# EAGLE design radio-v1.0 (EAGLE 8.1.0)
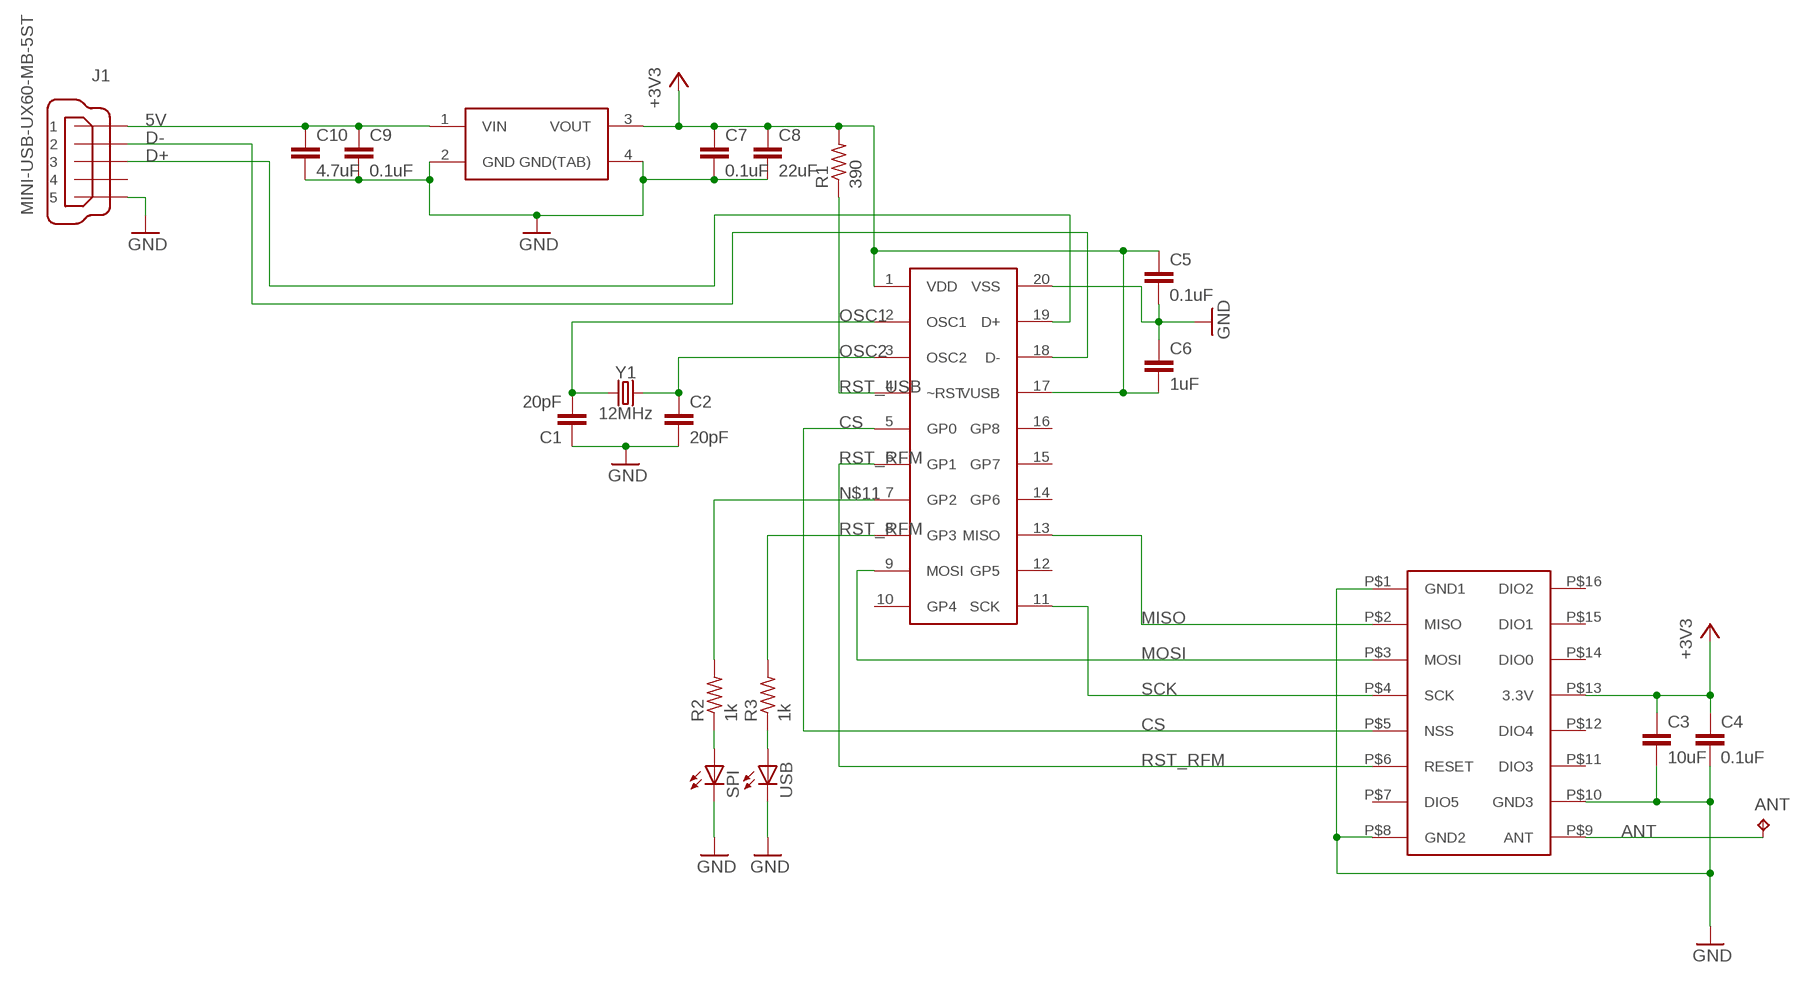
[diagram p0: schematic, sheet 1]

## Parts
ANT  TPPAD1-17Y  [P1-17Y]
C1  20pF  C-EUC0603  [C0603]
C2  20pF  C-EUC0603  [C0603]
C3  10uF  C-EUC0603  [C0603]
C4  0.1uF  C-EUC0603  [C0603]
C5  0.1uF  C-EUC0603  [C0603]
C6  1uF  C-EUC0603  [C0603]
C7  0.1uF  C-EUC0603  [C0603]
C8  22uF  C-EUC0603  [C0603]
C9  0.1uF  C-EUC0603  [C0603]
C10  4.7uF  C-EUC0603  [C0603]
J1  MINI-USB-UX60-MB-5ST  [UX60-MB-5ST]
R1  390  R-US_R0603  [R0603]
R2  1k  R-US_R0603  [R0603]
R3  1k  R-US_R0603  [R0603]
SPI  LED3MM  [LED3MM]
U1  MCP2210  [SOIC20S]
U2  RFM69HCW  [RFM69HCW]
U3  MCP1825S_DBMCP1825S_DB  [SOT223]
USB  LED3MM  [LED3MM]
Y1  12MHz  CRYSTAL-8MHZSMD-HC49UP  [HC49UP]

## Nets
5V: C9.1 C10.1 J1.1 U3.1(VIN)
+3V3: C3.1 C4.1 C5.1 C6.2 C7.1 C8.1 R1.2 U1.1(VDD) U1.17(VUSB) U2.P$13(3.3V) U3.3(VOUT)
ANT: ANT.TP U2.P$9(ANT)
CS: U1.5(GP0) U2.P$5(NSS)
D+: J1.3 U1.19(D+)
D-: J1.2 U1.18(D-)
GND: C1.1 C2.2 C3.2 C4.2 C5.2 C6.1 C7.2 C8.2 C9.2 C10.2 J1.5 SPI.K(C) U1.20(VSS) U2.P$1(GND1) U2.P$8(GND2) U2.P$10(GND3) U3.2(GND) U3.4(GND(TAB)) USB.K(C)
MISO: U1.13(MISO) U2.P$2(MISO)
MOSI: U1.9(MOSI) U2.P$3(MOSI)
N$9: R2.1 SPI.A
N$10: R3.1 USB.A
N$11: R2.2 U1.7(GP2)
N$12: R3.2 U1.8(GP3)
OSC1: C1.2 U1.2(OSC1) Y1.1
OSC2: C2.1 U1.3(OSC2) Y1.2
RST_RFM: U1.6(GP1) U2.P$6(RESET)
RST_USB: R1.1 U1.4(~RST)
SCK: U1.11(SCK) U2.P$4(SCK)
Unconnected: J1.4 U1.10(GP4) U1.12(GP5) U1.14(GP6) U1.15(GP7) U1.16(GP8) U2.P$7(DIO5) U2.P$11(DIO3) U2.P$12(DIO4) U2.P$14(DIO0) U2.P$15(DIO1) U2.P$16(DIO2)

## Library data of the parts
ANT = testpad:TP: Test pad
C1-C10 = resistor:C-EU: CAPACITOR, European symbol
J1 = con-hirose:MINI-USB-: MINI USB Connector Source: http://www.hirose.co.jp/cataloge_hp/e24000019.pdf; OC_FARNELL: unknown; OC_NEWARK: unknown
R1-R3 = resistor:R-US_: RESISTOR, American symbol
SPI USB = led:LED: LED OSRAM: - CHIPLED LG R971, LG N971, LY N971, LG Q971, LY Q971, LO R971, LY R971 LH N974, LH R974 LS Q976, LO Q976, LY Q976 LO Q996 - Hyper CHIPLED LW Q18S LB Q993, LB Q99A, LB R99A - SideLED LS A670, LO A670, LY A670, LG A670, LP A670 LB A673, LV A673, LT A673, LW A673 LH A674 LY A675 LS A676, LA A676, LO A676, LY A676, LW A676 LS A679, LY A679, LG A679 - Hyper Micro SIDELED® LS Y876, LA Y876, LO Y876, LY Y876 LT Y87S - SmartLED LW L88C, LW L88S LB L89C, LB L89S, LG L890 LS L89K, LO L89K, LY L89K LS L896, LA L896, LO L896, LY L896 - TOPLED LS T670, LO T670, LY T670, LG T670, LP T670 LSG T670, LSP T670, LSY T670, LOP T670, LYG T670 LG T671, LOG T671, LSG T671 LB T673, LV T673, LT T673, LW T673 LH T674 LS T676, LA T676, LO T676, LY T676, LB T676, LH T676, LSB T676, LW T676 LB T67C, LV T67C, LT T67C, LS T67K, LO T67K, LY T67K, LW E67C LS E67B, LA E67B, LO E67B, LY E67B, LB E67C, LV E67C, LT E67C LW T67C LS T679, LY T679, LG T679 LS T770, LO T770, LY T770, LG T770, LP T770 LB T773, LV T773, LT T773, LW T773 LH T774 LS E675, LA E675, LY E675, LS T675 LS T776, LA T776, LO T776, LY T776, LB T776 LHGB T686 LT T68C, LB T68C - Hyper Mini TOPLED® LB M676 - Mini TOPLED Santana® LG M470 LS M47K, LO M47K, LY M47K Source: http://www.osram.convergy.de LUXEON: - LUMILED® LXK2-PW12-R00, LXK2-PW12-S00, LXK2-PW14-U00, LXK2-PW14-V00 LXK2-PM12-R00, LXK2-PM12-S00, LXK2-PM14-U00 LXK2-PE12-Q00, LXK2-PE12-R00, LXK2-PE12-S00, LXK2-PE14-T00, LXK2-PE14-U00 LXK2-PB12-K00, LXK2-PB12-L00, LXK2-PB12-M00, LXK2-PB14-N00, LXK2-PB14-P00, LXK2-PB14-Q00 LXK2-PR12-L00, LXK2-PR12-M00, LXK2-PR14-Q00, LXK2-PR14-R00 LXK2-PD12-Q00, LXK2-PD12-R00, LXK2-PD12-S00 LXK2-PH12-R00, LXK2-PH12-S00 LXK2-PL12-P00, LXK2-PL12-Q00, LXK2-PL12-R00 Source: www.luxeon.com KINGBRIGHT: KA-3528ASYC Source: www.kingbright.com
U1 = library:MCP2210
U2 = library:RFM69HCW
U3 = library:MCP1825S_DB
Y1 = SparkFun-Clocks:CRYSTAL-8MHZ: 8MHz Crystal Datasheet Example <http://www.futureelectronics.com/en/technologies/electromechanical/timing-devices/crystals/Pages/6008189-ABM3B-8.000MHZ-B2-T.aspx?IM=0> Frequency: 8MHz Frequency Tolerance: ±20ppm Load Capacitance: 18pF SparkFun Products: Pro Micro -3.3V/8MHz <https://www.sparkfun.com/products/12587> WAV Trigger <https://www.sparkfun.com/products/13660>; PROD_ID: XTAL-11706; VALUE: 8MHz

## Net classes
0 default: width 0.152 mm, drill 0.254 mm, clearance 0.152 mm

## Board
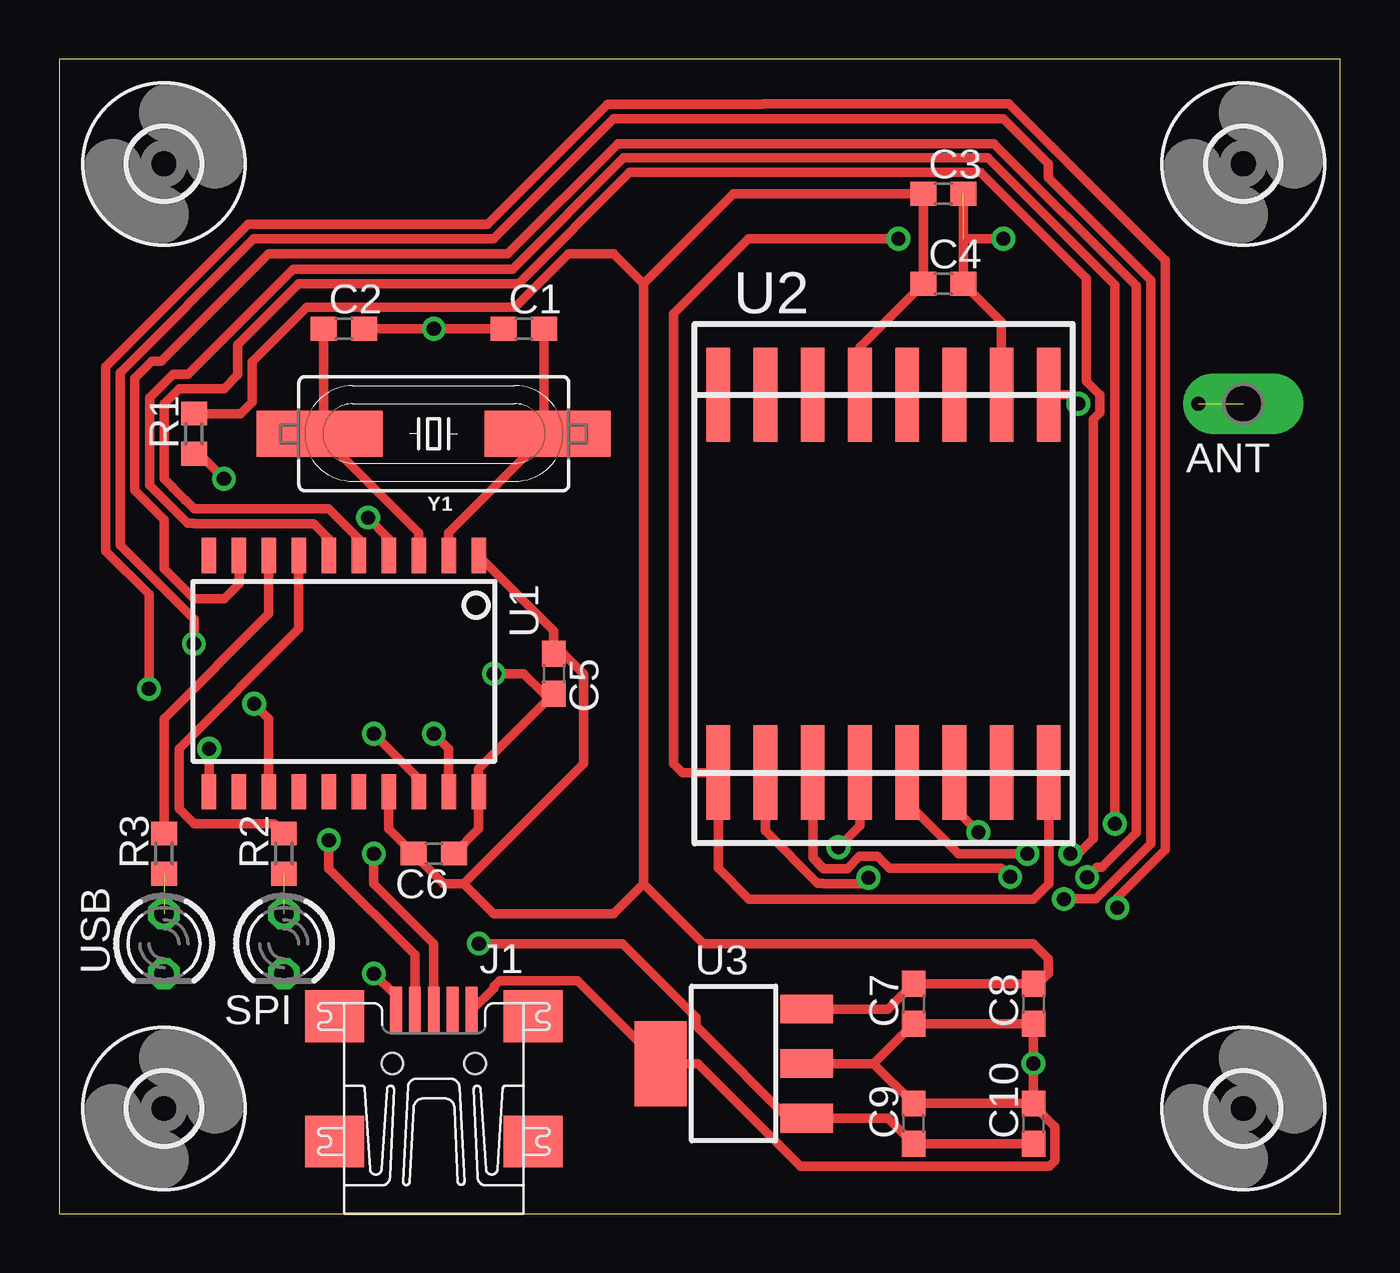
[diagram p1: board, top side]
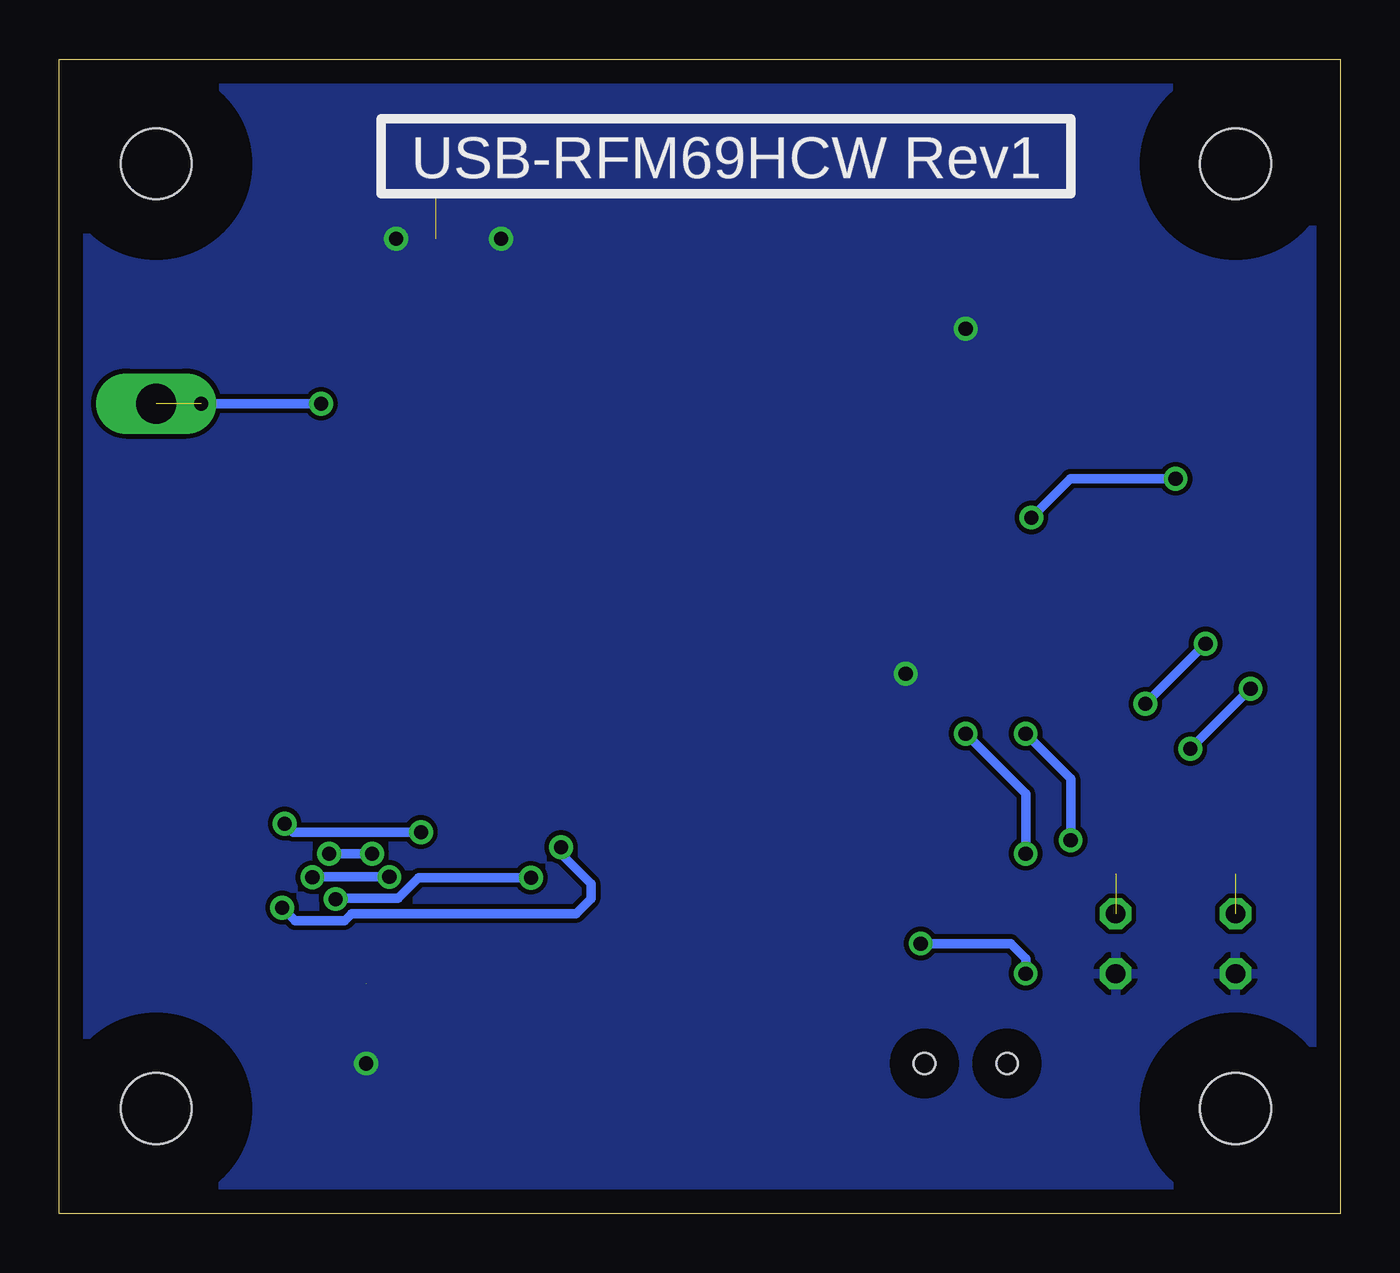
[diagram p2: board, bottom side, seen from below]

Size 54.28 x 48.88 mm. Coordinates in mm from the lower left corner, seen from the top.
Outline: 0,0 54.28,0 54.28,48.88 0,48.88 0,0
Copper layers (1*16): Top 0.035mm / dielectric 1.5mm / Bottom 0.035mm
Design rules "default": minimum track width 10mil, minimum drill 24mil, track to track 8mil, track to pad 8mil, pad to pad 8mil, via to via 8mil, smd to smd 8mil, copper to edge 40mil, drill to drill 8mil, minimum pad ring 10mil, minimum via ring 8mil, stop-mask expansion 4mil, vias tented up to drill 0mil, thermal gap 10mil

### Footprints (pad centres in the part's own frame; a part is rotated, then mirrored left to right if it is on the bottom)
P1-17Y = drill 1.702 pad 2.121 long: TP 0,0
C0603 = smd 1.1 x 1: 1 -0.85,0; 2 0.85,0
UX60-MB-5ST = smd 2 x 0.5: 1 2.25,1.6; 2 2.25,0.8; 3 2.25,0; 4 2.25,-0.8; 5 2.25,-1.6 | smd 2.2 x 2.5: M1 -3.3,-4.2; M2 -3.3,4.2; M3 2,4.2; M4 2,-4.2 | hole 0.9: 0,-1.75; 0,1.75
R0603 = smd 1 x 1.1: 1 -0.85,0; 2 0.85,0
LED3MM = drill 0.813 octagon: A -1.27,0; K 1.27,0
SOIC20S = smd 0.6 x 1.5: 1 -5.715,-5; 2 -4.445,-5; 3 -3.175,-5; 4 -1.905,-5; 5 -0.635,-5; 6 0.635,-5; 7 1.905,-5; 8 3.175,-5; 9 4.445,-5; 10 5.715,-5; 11 5.715,5; 12 4.445,5; 13 3.175,5; 14 1.905,5; 15 0.635,5; 16 -0.635,5; 17 -1.905,5; 18 -3.175,5; 19 -4.445,5; 20 -5.715,5
RFM69HCW = smd 4 x 1: P$1 -8,7; P$2 -8,5; P$3 -8,3; P$4 -8,1; P$5 -8,-1; P$6 -8,-3; P$7 -8,-5; P$8 -8,-7; P$9 8,-7; P$10 8,-5; P$11 8,-3; P$12 8,-1; P$13 8,1; P$14 8,3; P$15 8,5; P$16 8,7
SOT223 = smd 1.219 x 2.235: 1 -2.311,-3.099; 2 0,-3.099; 3 2.311,-3.099 | smd 3.6 x 2.2: 4 0,3.099
3,0 = hole 3: 0,0
HC49UP = smd 5.334 x 1.93: 1 -4.826,0; 2 4.826,0

### Placement (x,y rotation side)
ANT  50.16,34.29 90 top
C1  19.68,37.47 0 top
C2  12.06,37.47 0 top
C3  37.47,43.18 0 top
C4  37.47,39.37 0 top
C5  20.95,22.86 270 top
C6  15.88,15.24 180 top
C7  36.2,8.89 270 top
C8  41.27,8.89 270 top
C9  36.2,3.81 90 top
C10  41.27,3.81 90 top
J1  15.88,6.35 90 top
R1  5.71,33.02 90 top
R2  9.53,15.24 90 top
R3  4.45,15.24 90 top
SPI  9.53,11.43 270 top
U1  12.06,22.86 180 top
U2  34.92,26.67 90 top
U3  28.57,6.35 90 top
U$4  [3,0]  50.16,44.45 0 top
U$5  [3,0]  4.45,44.45 0 top
U$6  [3,0]  4.45,4.45 0 top
U$7  [3,0]  50.16,4.45 0 top
USB  4.45,11.43 270 top
Y1  15.88,33.02 180 top

### Tracks (layer width: path | path; a pad name or v marks a point on that pad's centre or on a via)
5V  (via drill 0.6)
  Top 0.406: C10.1 C9.1 35.12,4.04 U3.1 31.45,3.81 31.11,3.81 26.98,7.94 26.98,8.32 23.87,11.43 v17.78,11.43 | J1.1 14.28,9.22 v13.34,10.16
  Bottom 0.406: v13.34,10.16 13.34,10.79 13.97,11.43 v17.78,11.43
+3V3  (1 unrouted)
  Top 0.406: U3.3 35.12,8.66 C7.1 C8.1 41.49,9.74 41.91,10.16 41.91,10.79 41.27,11.43 27.3,11.43 24.77,13.97 | U1.1 20.95,24.68 C5.1 21.38,23.71 22.23,22.86 22.23,19.05 17.14,13.97 | U2.P$13 33.92,36.68 C4.1 C3.1 28.57,43.18 24.77,39.37 | U1.17 13.97,16.3 C6.2 16.3,13.97 17.14,13.97 | 24.77,13.97 24.77,39.37 | 24.77,13.97 23.5,12.7 18.41,12.7 17.14,13.97 | 24.77,39.37 23.5,40.64 21.59,40.64 19.32,38.38 15.5,38.38 15.49,38.37 10.5,38.37 8.18,36.06 8.18,34.36 7.69,33.87 R1.2
ANT  (via drill 0.6)  (1 unrouted)
  Top 0.406: U2.P$9 42.8,34.67 v43.18,34.29
  Bottom 0.406: v43.18,34.29 v48.26,34.29
CS  (via drill 0.6)
  Top 0.406: U1.5 12.7,28.57 11.43,29.84 5.71,29.84 5.36,30.2 5.34,30.2 4.8,30.74 4.8,30.75 4.45,31.11 4.45,34.29 5.08,34.92 6.99,34.92 7.57,35.51 7.57,36.78 10.16,39.37 19.46,39.37 24.17,44.09 39.03,44.09 43.52,39.6 43.52,35.24 44.09,34.67 44.09,33.91 43.81,33.64 43.81,15.88 43.18,15.24 v42.84,15.24 | U2.P$5 35.92,17.41 38.1,15.24 v41.02,15.24
  Bottom 0.406: v41.02,15.24 v42.84,15.24
D+  (via drill 0.6)
  Top 0.406: U1.19 16.51,19.68 v15.88,20.32 | v13.34,15.24 13.34,13.97 15.88,11.43 J1.3
  Bottom 0.406: v13.34,15.24 13.34,17.78 v15.88,20.32
D-  (via drill 0.6)
  Top 0.406: J1.2 15.07,10.96 11.43,14.61 v11.43,15.81 | U1.18 15.24,18.41 v13.34,20.32
  Bottom 0.406: v13.34,20.32 11.43,18.41 v11.43,15.81
GND  (via drill 0.6)  (1 unrouted)
  Top 0.406: 34.51,6.35 C7.2 C8.2 v41.27,6.35 C10.2 | U3.2 34.51,6.35 | 34.51,6.35 C9.2 C10.2 | J1.5 18.42,9.54 18.42,9.62 18.66,9.86 21.97,9.86 U3.4 27.06,6.35 31.41,2 41.94,2 42.18,2.24 42.18,3.68 41.27,4.58 C10.2 | C2.2 v15.88,37.47 C1.1 | C3.2 C4.2 39.92,37.76 U2.P$10 | C6.1 17.78,16.3 U1.20 17.78,18.84 C5.2 20.54,22.01 19.68,22.86 v18.41,22.86 | U2.P$8 41.92,13.96 41.27,13.31 29.23,13.31 27.93,14.62 U2.P$1 26.41,18.67 26.04,19.05 26.04,38.1 29.21,41.27 v35.56,41.27 | 38.31,41.27 v40.01,41.27
  pour Bottom: 0.64,48.26 53.98,48.26 53.98,0 0.64,0
MISO  (via drill 0.6)
  Top 0.406: U1.13 8.89,20.95 v8.26,21.58 | v5.71,24.13 5.71,25.17 2.59,28.3 2.59,35.61 8.26,41.27 18.41,41.27 23.5,46.35 40.01,46.35 41.91,44.45 41.91,43.86 46.24,39.53 46.24,15.65 43.92,13.33 42.58,13.33 v42.57,13.31 | 29.93,17.07 U2.P$2 29.93,16.2 32.13,13.99 32.36,13.99 32.38,13.97 34.04,13.97 v34.29,14.22
  Bottom 0.406: v8.26,21.58 v5.71,24.13 | v42.57,13.31 42.53,13.35 39.91,13.35 39.04,14.22 v34.29,14.22
MOSI  (via drill 0.6)
  Top 0.406: U1.9 7.62,26.67 6.99,26.04 5.71,26.04 4.45,27.3 4.45,29.37 3.2,30.62 3.2,35.36 3.92,36.08 4.33,36.08 8.89,40.64 19,40.64 23.67,45.31 39.6,45.31 45.63,39.27 45.63,16.13 44.16,14.66 43.97,14.66 v43.55,14.24 | 31.93,16.97 U2.P$3 31.93,15.06 32.38,14.61 33.39,14.61 33.91,15.13 34.67,15.13 35.16,14.63 39.91,14.63 v40.29,14.26
  Bottom 0.406: v40.29,14.26 43.53,14.26 v43.55,14.24
N$9  (1 unrouted)
N$10  (1 unrouted)
N$11
  Top 0.406: U1.7 10.16,24.77 5.08,19.68 5.08,17.14 5.71,16.51 9.11,16.51 R2.2
N$12
  Top 0.406: U1.8 8.89,25.4 4.45,20.95 R3.2
OSC1
  Top 0.406: U1.2 16.51,28.83 Y1.1 20.54,33.19 C1.2
OSC2
  Top 0.406: C2.1 11.21,33.19 Y1.2 15.24,28.83 U1.3
RST_RFM  (via drill 0.6)
  Top 0.406: U1.6 11.43,28.57 10.79,29.21 5.71,29.21 5.69,29.23 5.45,29.23 3.83,30.85 3.83,34.29 | U2.P$6 37.92,17.17 v38.95,16.15 | 3.83,34.29 3.83,34.54 | 44.7,16.54 v44.73,16.51 44.73,39.32 39.35,44.7 23.92,44.7 19.2,39.98 9.91,39.98 5.46,35.53 4.83,35.53 3.83,34.54 | 3.83,34.29 3.83,34.54
  Bottom 0.406: v38.95,16.15 44.36,16.15 v44.73,16.51
RST_USB  (via drill 0.6)
  Top 0.406: R1.1 5.93,32.17 v6.99,31.11 | v13.09,29.47 13.09,29.45 13.97,28.57 U1.4
  Bottom 0.406: v6.99,31.11 11.45,31.11 v13.09,29.47
SCK  (via drill 0.6)
  Top 0.406: U1.11 v6.35,19.67 v6.36,19.68 | v3.81,22.23 3.81,26.22 1.98,28.05 1.98,35.86 8,41.88 18.16,41.88 23.24,46.97 29.82,46.97 29.84,46.99 40.23,46.99 42.02,45.2 | U2.P$4 33.92,16.43 v33.01,15.52 | v44.83,12.95 44.83,13.38 46.85,15.4 46.85,25.4 | 42.02,45.2 42.16,45.06 | 46.85,25.4 46.85,26.94 | 42.02,45.2 42.16,45.06 | 42.16,45.06 46.85,40.37 46.85,25.4
  Bottom 0.406: v6.36,19.68 v3.81,22.23 | v33.01,15.52 33.01,15.23 31.75,13.97 31.75,13.34 32.38,12.7 41.89,12.7 42.19,12.4 44.28,12.4 v44.83,12.95

### Text on the board
bPlace: USB-RFM69HCW Rev1
tNames: U2